# EasyEDA Pro project ProPrj_智能视觉集成板-V1.1.epro, board PCB2_1
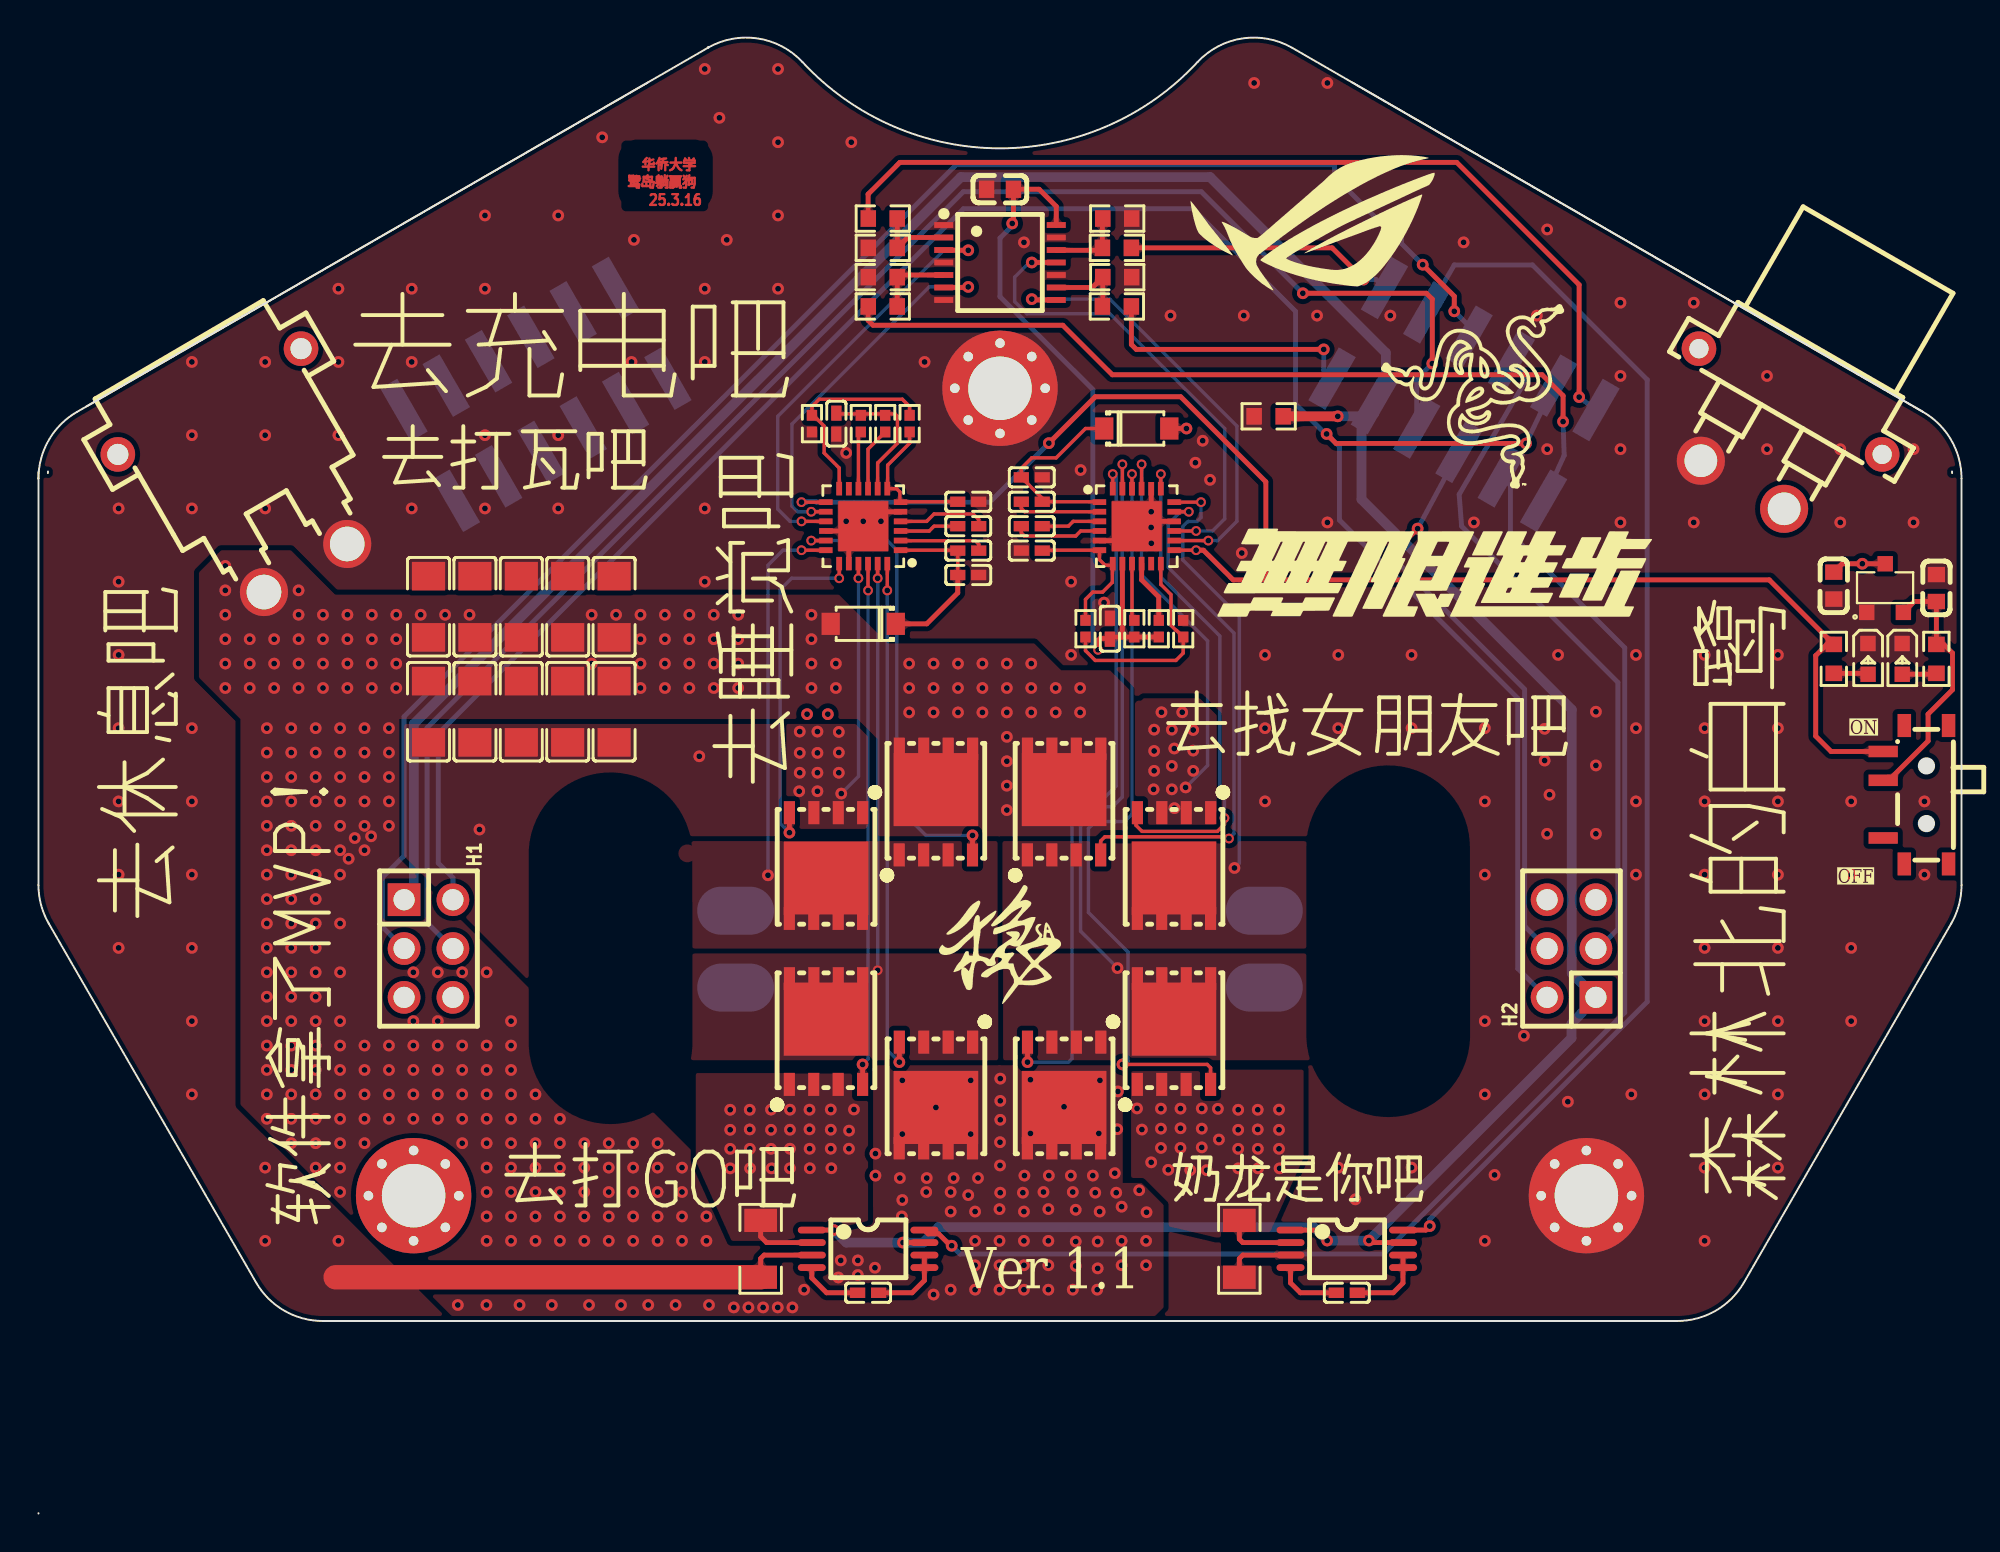
[diagram p9: board, top side]
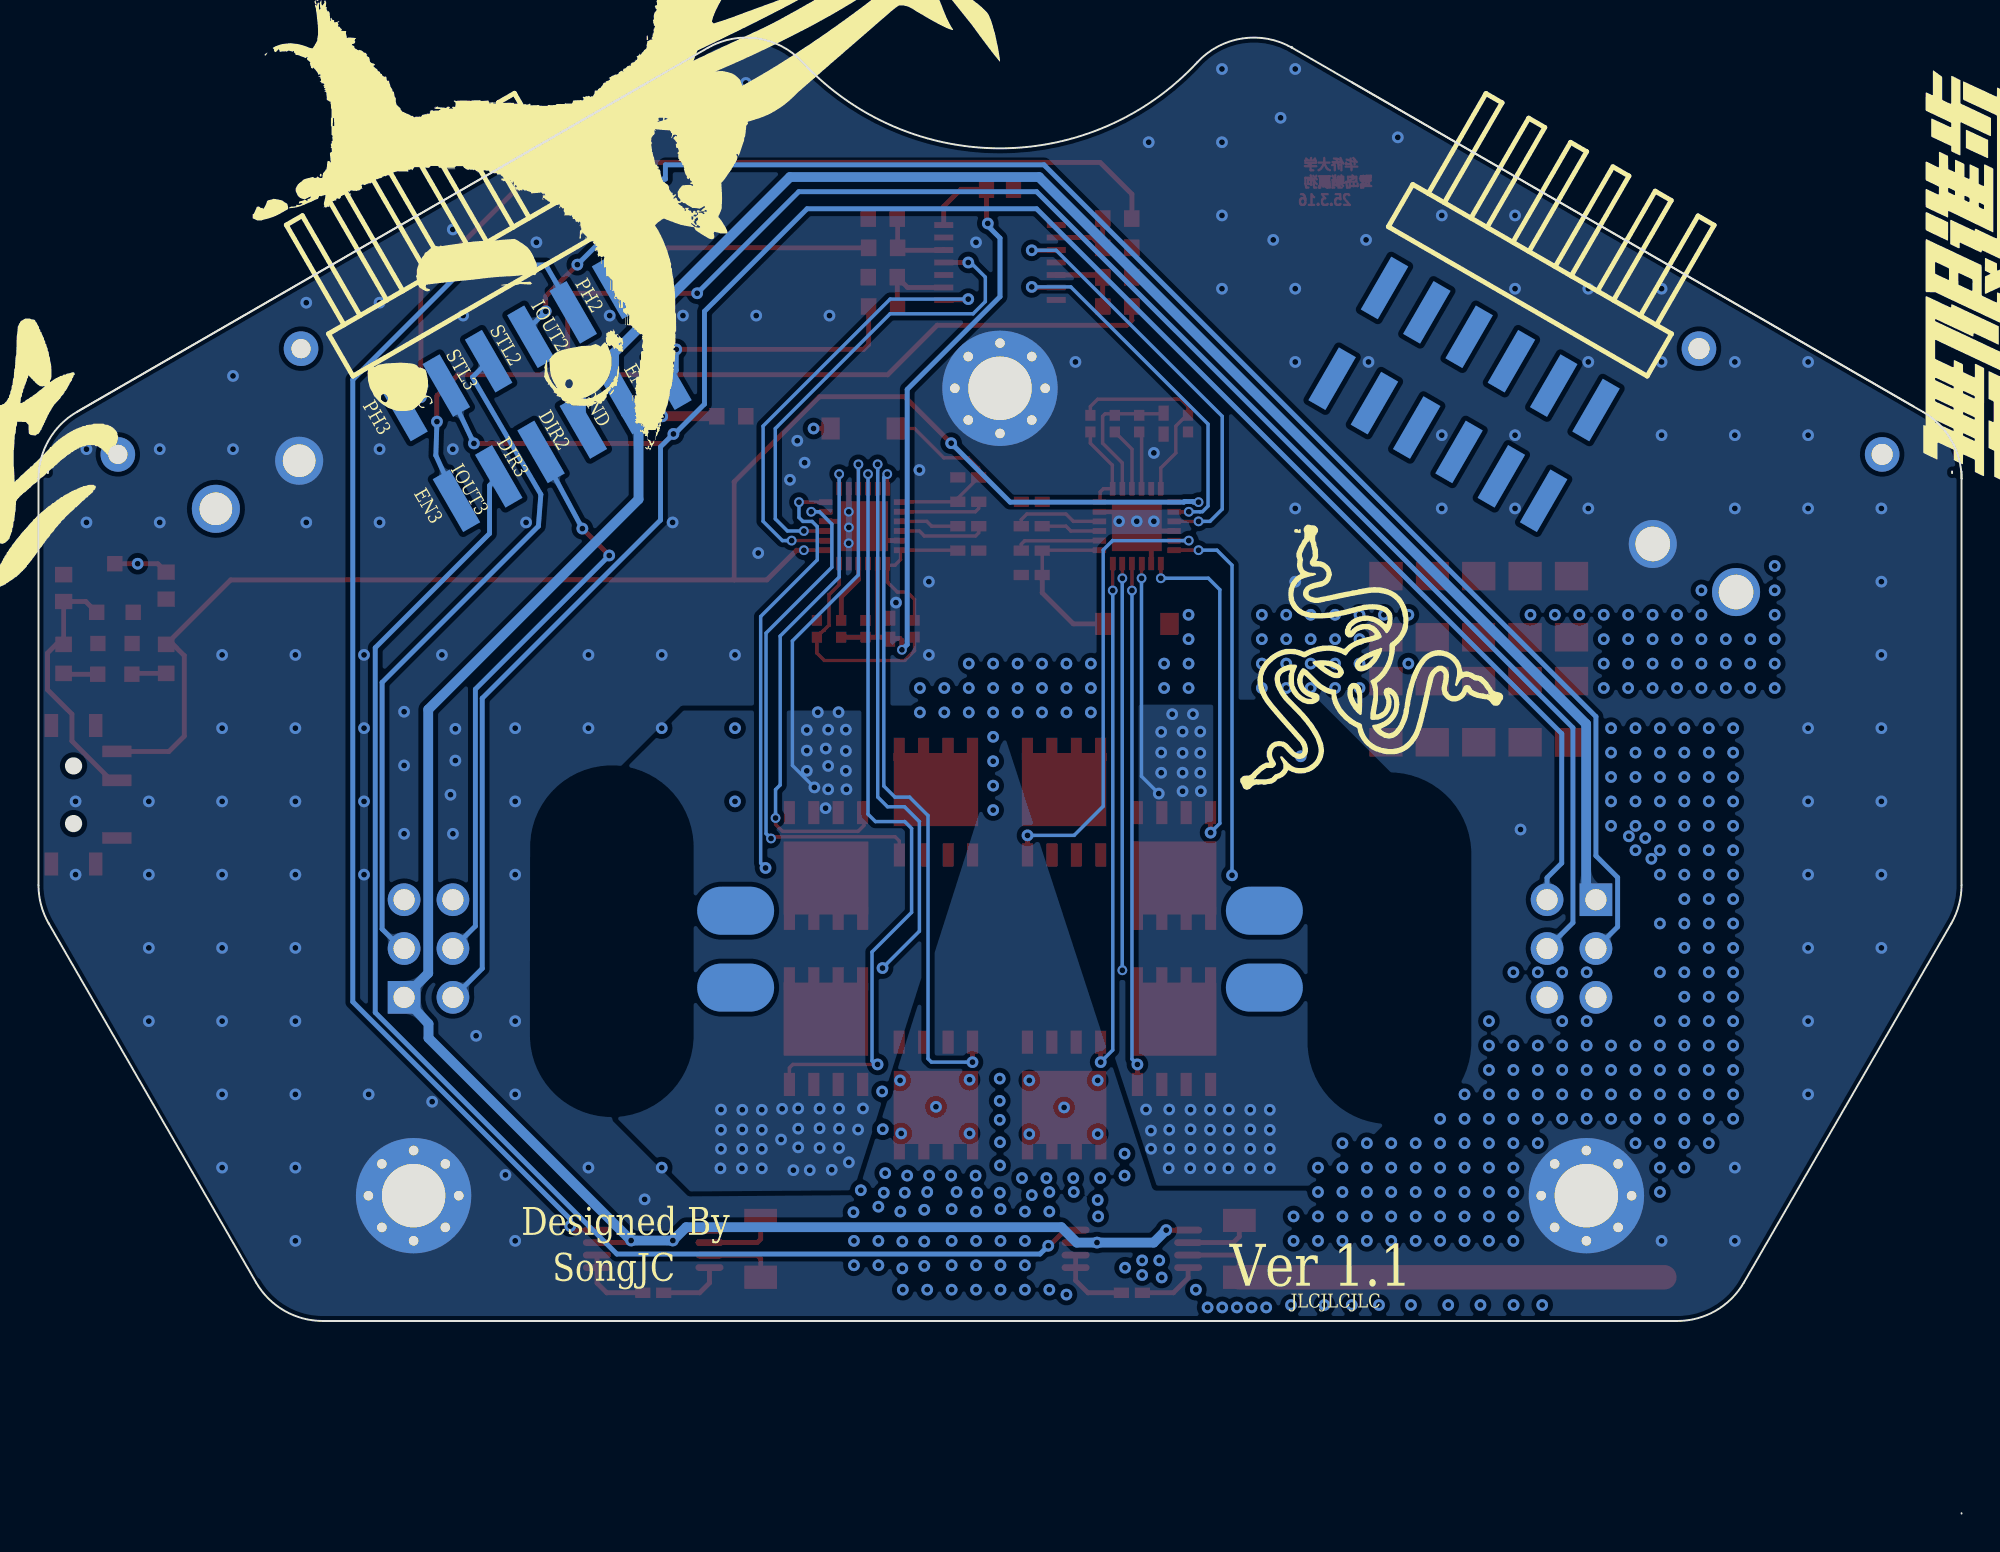
[diagram p10: board, bottom side, seen from below]

Outline 100 x 76.73 mm; copper layers: Top Layer, Inner1, Inner2, Bottom Layer. Coordinates in mm from the lower left corner of the outline.
Outline path: 0,54.21 0,53.84 ; 0,53.84 0,32.69 arc(0.14,31.66) 0.54,30.69 11.32,12.02 arc(12.78,10.55) 14.78,10.02 85.22,10.02 arc(87.22,10.55) 88.68,12.02 99.46,30.69 arc(99.86,31.66) 100,32.69 100,53.84 arc(99.46,55.84) 98,57.3 ; 0,53.84 arc(0.54,55.84) 2,57.3 34.84,76.27 ; 0,0.02 0,0 ; 0.49,54.21 0.49,54.13 ; 31.71,74.46 2.49,57.59 ; 34.8,76.24 arc(37.4,76.73) 39.73,75.5 arc(50,71.02) 60.27,75.5 arc(62.6,76.73) 65.2,76.24 98,57.3 ; 34.83,76.3 arc(34.83,76.3) 34.83,76.3 ; 98,57.3 68.29,74.46 ; 99.51,54.21 99.51,54.13
Stack: Top Layer 0.035mm 外层铜厚1oz / Dielectric1 0.2104mm 7628 RC49% 8.6mil / Inner1 0.0152mm 内层铜厚 / Dielectric2 1.065mm 1.1mm H/HOZ Copper / Inner2 0.0152mm 内层铜厚 / Dielectric3 0.2104mm 7628 RC49% 8.6mil / Bottom Layer 0.035mm 外层铜厚1oz

## Design rules (mm)
template: 自定义配置
spacing copperThickness1oz (default): track to track 0.102, other pairs 0.14 to 0.3
spacing copperThickness2oz: track to track 0.203, other pairs 0.152 to 0.3
track width copperThickness1oz (default): min 0.127, default 0.254, max 2.54
track width copperThickness2oz: min 0.203, default 0.254, max 2.54
differential pair differentialPair (default): width min 0.127, default 0.254, max 2.54; gap min 0.152, default 0.152
via viaSize (default): diameter min 0.5, default 0.61, max 10; hole min 0.3, default 0.305, max 6.299
net VCC_BAT uses copperRegion1
net GND_MOTO uses copperRegion1
net SH2_2 uses copperRegion1
net SP_2 uses copperRegion1
net SH1_2 uses copperRegion1
net SH2_3 uses copperRegion1
net SP_3 uses copperRegion1
net SH1_3 uses copperRegion1

## Placement (name value [footprint] x y rotation side)
C44  1nF  [C0603]  93.36 48.27 90 top
C45  1nF  [C0603]  98.69 48.14 270 top
C94  22uF  [c1206]  25.11 47.17 270 top
C95  22uF  [c1206]  22.69 47.17 270 top
C96  22uF  [c1206]  20.28 47.17 270 top
C97  22uF  [c1206]  20.28 41.71 90 top
C132  100nF  [C0603]  50 68.89 0 top
C133  22uF  [c1206]  29.93 47.17 270 top
C134  22uF  [c1206]  27.52 47.17 270 top
C135  22uF  [c1206]  22.69 41.71 90 top
C136  22uF  [c1206]  25.11 41.71 90 top
C137  22uF  [c1206]  27.52 41.71 90 top
C142  22uF  [c1206]  29.93 41.71 90 top
C143  100nF  [C0402]  51.65 53.9 180 top
C144  100nF  [C0402]  51.65 52.63 180 top
C145  100nF  [C0402]  51.65 51.36 180 top
C146  1uF  [C0402]  51.65 50.09 0 top
C147  1uF  [C0402]  55.72 46.03 270 top
C148  100nF  [C0402]  68.03 11.48 180 top
C149  100nF  [C0402]  48.35 48.82 180 top
C150  100nF  [C0402]  48.35 50.09 0 top
C151  100nF  [C0402]  48.35 51.36 0 top
C152  1uF  [C0402]  48.35 52.63 180 top
C153  1uF  [C0402]  41.49 56.7 90 top
C154  100nF  [C0402]  43.14 11.48 180 top
CN6  XT30PW-M30.G.Y  [CONN-TH_XT30PW-M]  11.39 53.52 210 top
D29  B5819W  [SOD-123_L2.8-W1.8-LS3.7-RD]  57.11 56.44 0 top
D30  B5819W  [SOD-123_L2.8-W1.8-LS3.7-RD]  42.89 46.28 180 top
H1  PZ254V-12-6P  [HDR-TH_6P-P2.54-V-M-R2-C3-S2.54]  20.28 29.39 270 top
H2  PZ254V-12-6P  [HDR-TH_6P-P2.54-V-M-R2-C3-S2.54]  79.72 29.39 90 top
J1  -  [M3螺帽]  19.51 16.54 0 top
J2  -  [M3螺帽]  50 58.54 0 top
J4  -  [M3螺帽]  80.49 16.54 0 top
LED4  NCD0603R1  [LED0603-RD_RED]  96.91 44.46 270 top
LED5  NCD0603R1  [LED0603-RD_RED]  95.14 44.46 270 top
Q25  IRFH7440TRPBF  [DFN-8_L5.8-W4.9-P1.27-LS6.0-BL-1]  53.33 21.77 180 top
Q26  IRFH7440TRPBF  [DFN-8_L5.8-W4.9-P1.27-LS6.0-BL-1]  59.05 25.07 0 top
Q27  IRFH7440TRPBF  [DFN-8_L5.8-W4.9-P1.27-LS6.0-BL-1]  53.33 37.01 0 top
Q28  IRFH7440TRPBF  [DFN-8_L5.8-W4.9-P1.27-LS6.0-BL-1]  59.05 33.71 180 top
Q29  IRFH7440TRPBF  [DFN-8_L5.8-W4.9-P1.27-LS6.0-BL-1]  46.67 21.77 180 top
Q30  IRFH7440TRPBF  [DFN-8_L5.8-W4.9-P1.27-LS6.0-BL-1]  40.95 25.07 0 top
Q31  IRFH7440TRPBF  [DFN-8_L5.8-W4.9-P1.27-LS6.0-BL-1]  46.67 37.01 0 top
Q32  IRFH7440TRPBF  [DFN-8_L5.8-W4.9-P1.27-LS6.0-BL-1]  40.95 33.71 180 top
R68  2.2K  [R0603]  98.69 44.46 90 top
R69  2.2K  [R0603]  93.36 44.46 90 top
R89  100R  [R0603]  56.08 65.84 0 top
R90  100R  [R0603]  56.08 62.79 0 top
R173  10kΩ  [R0603]  43.9 64.32 0 top
R174  10kΩ  [R0603]  43.9 65.84 0 top
R175  10kΩ  [R0603]  56.1 64.32 180 top
R176  10kΩ  [R0603]  56.1 67.36 180 top
R177  10kΩ  [R0402]  56.99 46.03 90 top
R178  10kΩ  [R0402]  58.26 46.03 90 top
R179  1kΩ  [R0402]  54.44 46.03 270 top
R180  33kΩ  [R0402]  59.53 46.03 270 top
R181  10kΩ  [R0402]  44.03 56.7 270 top
R182  10kΩ  [R0402]  42.76 56.7 270 top
R183  1kΩ  [R0402]  45.3 56.7 90 top
R184  33kΩ  [R0402]  40.22 56.7 90 top
R185  100R  [R0603]  43.9 67.36 180 top
R186  100R  [R0603]  43.9 62.79 180 top
R187  0Ω  [R0603]  63.97 57.08 180 top
SW4  MSK12C02  [SW-TH_MSK12C02]  97.62 37.39 90 top
U10  LR8341A-T33  [SOT-23-3L_L2.9-W1.6-P1.90-LS2.8-BL]  96.02 48.14 0 top
U11  SN74HC125PWR  [TSSOP-14_L5.0-W4.4-P0.65-LS6.5-BL]  50 65.08 270 top
U56  XT30PW-F20.G.Y  [CONN-TH_XT30PW-F-1]  89.86 55.68 150 top
U57  PZ254-2-06-WS  [HDR-SMD_12P-P2.54_HCTL_PZ254-2-06-WS]  25.87 58.22 30 bottom
U58  PZ254-2-06-WS  [HDR-SMD_12P-P2.54_HCTL_PZ254-2-06-WS]  74.13 58.22 330 bottom
U59  100mΩ  [R1206]  62.45 13.77 270 top
U60  DRV8701ERGER  [VQFN-24_L4.0-W4.0-P0.50-BL-EP2.5]  57.11 51.36 270 top
U61  INA240A2PWR  [TSSOP-8_L4.4-W3.0-P0.65-LS6.4-BL]  68.03 13.77 270 top
U62  -  [2P焊接端子（大电流）]  63.75 29.36 0 bottom
U63  100mΩ  [R1206]  37.55 13.77 270 top
U64  DRV8701ERGER  [VQFN-24_L4.0-W4.0-P0.50-BL-EP2.5]  42.89 51.36 90 top
U65  INA240A2PWR  [TSSOP-8_L4.4-W3.0-P0.65-LS6.4-BL]  43.14 13.77 270 top
U66  -  [2P焊接端子（大电流）]  36.25 29.36 0 bottom

## Footprints (pads in the part's own frame, mm; a bottom-side part is the same pattern mirrored in y, then rotated)
2P焊接端子（大电流）
  oval 4x2.5 smd: 1(0,2) 2(0,-2)
C0402
  rect 0.79x0.54 smd: 1(-0.545,0) 2(0.545,0)
C0603
  rect 0.8x0.9 smd: 1(-0.7,0) 2(0.7,0)
c1206
  rect 1.485x1.728 smd: 1(-1.593,0) 2(1.593,0)
CONN-TH_XT30PW-F-1
  round 2.5 hole 1.7: 1(-2.5,2.5) 2(2.5,2.5)
  round 1.8 hole 1: 3(5.5,-2.5) 4(-5.5,-2.5)
CONN-TH_XT30PW-M
  round 2.5 hole 1.8: 1(-2.5,5) 2(2.5,5)
  round 1.8 hole 1.1: 3(5.5,-5) 4(-5.5,-5)
DFN-8_L5.8-W4.9-P1.27-LS6.0-BL-1
  rect 0.58x1.2 smd: 1(-1.907,-2.75) 2(-0.637,-2.75) 3(0.632,-2.75) 4(1.903,-2.75) 5(1.907,2.75) 6(0.637,2.75) 7(-0.632,2.75) 8(-1.903,2.75)
  rect 4.4x3.8 smd: 9(0,0.646)
HDR-SMD_12P-P2.54_HCTL_PZ254-2-06-WS
  rect 1.02x3.17 smd: 1(-6.35,-2.725) 2(-6.35,2.725) 3(-3.81,-2.725) 4(-3.81,2.725) 5(-1.27,-2.725) 6(-1.27,2.725) 7(1.27,-2.725) 8(1.27,2.725) 9(3.81,-2.725) 10(3.81,2.725) 11(6.35,-2.725) 12(6.35,2.725)
HDR-TH_6P-P2.54-V-M-R2-C3-S2.54
  rect 1.7x1.7 hole 1.1: 1(-2.54,-1.27)
  round 1.7 hole 1.1: 2(-2.54,1.27) 3(0,-1.27) 4(0,1.27) 5(2.54,-1.27) 6(2.54,1.27)
LED0603-RD_RED
  rect 0.8x0.8 smd: 1(-0.799,-0.004) 2(0.799,0.004)
M3螺帽
  round 6 hole 3.302: 1(0,0)
  round 1 hole 0.5: 2(0,2.349) 3(0,-2.349) 4(2.349,0) 5(-2.349,0) 6(1.651,1.651) 7(-1.651,-1.651) 8(1.651,-1.651) 9(-1.651,1.651)
R0402
  rect 0.566x0.54 smd: 1(-0.433,0) 2(0.433,0)
R0603
  rect 0.806x0.864 smd: 1(-0.753,0) 2(0.753,0)
R1206
  rect 1.208x1.701 smd: 1(-1.479,0) 2(1.479,0)
SOD-123_L2.8-W1.8-LS3.7-RD
  rect 0.95x1.15 smd: 1(-1.692,0) 2(1.692,0)
SOT-23-3L_L2.9-W1.6-P1.90-LS2.8-BL
  rect 0.8x0.8 smd: 1(-0.95,-1.265) 2(0.95,-1.265) 3(0.005,1.265)
SW-TH_MSK12C02
  rect 0.6x1.524 smd: 1(-2.25,1.7) 2(0.75,1.7) 3(2.25,1.7)
  rect 1.2x0.7 smd: 4(-3.6,0.6) 4(-3.6,-1.7) 4(3.6,0.6) 4(3.6,-1.7)
TSSOP-8_L4.4-W3.0-P0.65-LS6.4-BL
  oval 0.353x1.454 smd: 1(-0.975,-2.927) 2(-0.325,-2.927) 3(0.325,-2.927) 4(0.975,-2.927) 5(0.975,2.927) 6(0.325,2.927) 7(-0.325,2.927) 8(-0.975,2.927)
TSSOP-14_L5.0-W4.4-P0.65-LS6.5-BL
  rect 0.305x0.991 smd: 1(-1.95,-2.925) 2(-1.3,-2.925) 3(-0.65,-2.925) 4(0,-2.925) 5(0.65,-2.925) 6(1.3,-2.925) 7(1.95,-2.925) 8(1.95,2.925) 9(1.3,2.925) 10(0.65,2.925) 11(0,2.925) 12(-0.65,2.925) 13(-1.3,2.925) 14(-1.95,2.925)
VQFN-24_L4.0-W4.0-P0.50-BL-EP2.5
  rect 0.3x0.7 smd: 1(-1.25,-1.942) 2(-0.75,-1.942) 3(-0.25,-1.942) 4(0.25,-1.942) 5(0.75,-1.942) 6(1.25,-1.942) 13(1.25,1.942) 14(0.75,1.942) 15(0.25,1.942) 16(-0.25,1.942) 17(-0.75,1.942) 18(-1.25,1.942)
  rect 0.7x0.3 smd: 7(1.948,-1.25) 8(1.948,-0.75) 9(1.948,-0.25) 10(1.948,0.25) 11(1.948,0.75) 12(1.948,1.25) 19(-1.948,1.25) 20(-1.948,0.75) 21(-1.948,0.25) 22(-1.948,-0.25) 23(-1.948,-0.75) 24(-1.948,-1.25)
  rect 2.6x2.6 smd: 25(0.001,-0.001)

## Nets
As in the schematic, except:
GND_MOTO: C44.1 C45.1 C94.1 C95.1 C96.1 C97.1 C132.1 C133.1 C134.1 C135.1 C136.1 C137.1 C142.1 C143.1 C146.1 C147.1 C149.1 C152.1 C153.1 CN6.1 J1.1 J1.2 J1.3 J1.4 J1.5 J1.6 J1.7 J1.8 J1.9 J2.1 J2.2 J2.3 J2.4 J2.5 J2.6 J2.7 J2.8 J2.9 J4.1 J4.2 J4.3 J4.4 J4.5 J4.6 J4.7 J4.8 J4.9 LED4.1 LED5.1 R173.1 R174.1 R175.1 R176.1 R180.1 R184.1 R187.2 U10.1 U11.1 U11.4 U11.7 U11.10 U11.13 U56.2 U59.2 U60.5 U60.16 U60.20 U60.25 U61.3 U63.2 U64.5 U64.16 U64.20 U64.25 U65.3

Pads without a net: CN6 3 4; H1 5 6; H2 5 6; SW4 1 4; U56 1 3 4; U57 1 2 3 4 5 6 7 8 9 10 11 12; U60 11; U64 11

## Via types
v1: diameter 0.61, hole 0.305, Top Layer to Bottom Layer, 622 vias
v2: diameter 0.508, hole 0.305, Top Layer to Bottom Layer, 27 vias

## Routing (per net, layer and track width the routed paths; a pad name or vN(x,y) marks a point on that pad's centre or on a via; arc(x,y) is an arc through that point)
+3V3: length 13.5
  Top Layer w0.254: SW4.2 96.22,38.14 98.26,40.19 98.26,41.58 99.53,42.85 99.53,44.76 99.08,45.21 R68.2 C45.2 97.54,47.44 U10.2
AVDD_2: length 8.1
  Top Layer w0.178: 55.84,49.39 U60.7 ; 55.84,49.39 55.78,49.33 55.46,49.33 55.17,49.62 U60.6 52.22,50.11 C146.2 ; 55.84,49.39 55.84,48.44 55.33,47.93 54.83,47.93 54.44,47.55 R179.1
AVDD_3: length 7.7
  Top Layer w0.178: C152.2 44.85,52.63 U64.6 44.79,52.65 44.79,53.14 44.62,53.31 U64.7 44.16,53.33 44.16,54.54 45.3,55.68 R183.1
DVDD_2: length 37.5
  Top Layer w0.178: 55.83,45.6 C147.2
  Top Layer w0.254: v2(55.1,44.93) 55.1,45.41 55.21,45.52 55.68,45.52 C147.2 ; 56.34,45.6 56.36,45.62 U60.8 ; 56.34,45.6 55.83,45.6 ; 56.34,45.6 R177.1 R178.1 ; v1(50.63,67.11) 50.7,67.18 C132.2 52.03,68.89 52.93,68 U11.14
  Bottom Layer w0.254: v1(50.63,67.11) 50.63,66.98 50,66.35 50,63.3 54.83,58.47 54.83,45.2 v2(55.1,44.93)
DVDD_3: length 7.4
  Top Layer w0.178: C153.2 41.53,57.2 44.54,57.2 44.67,57.08 44.67,55.68 43.64,54.65 U64.8
GND_MOTO: length 41.9
  Top Layer w0.254: U59.2 62.45,13.26 62.63,13.45 U61.3 ; 57.36,51.61 U60.25 56.36,50.61 U60.5 ; 57.36,51.61 U60.16 ; 57.36,51.61 v2(57.86,52.11) U60.20 ; U64.16 42.64,51.11 ; 42.64,51.11 42.14,50.61 U64.20 ; 42.64,51.11 U64.25 43.64,52.11 U64.5 ; U65.3 37.74,13.45 37.55,13.26 U63.2
  Top Layer w1.27: U63.2 15.46,12.29
  vias: v1(4.17,52.29) v1(4.17,48.48) v1(4.17,44.67) v1(4.17,40.86) v1(4.17,37.05) v1(4.17,33.24) v1(4.17,29.43) v1(7.98,59.91) v1(7.98,56.1) v1(7.98,52.29) v1(7.98,40.86) v1(7.98,37.05) v1(7.98,33.24) v1(7.98,29.43) v1(7.98,25.62) v1(7.98,21.81) v1(11.79,59.91) v1(11.79,56.1) v1(11.79,52.29) v1(11.79,18) v1(11.79,14.19) v1(15.6,63.72) v1(15.6,59.91) v1(15.6,56.1) v1(15.6,14.19) v1(19.41,63.72) v1(19.41,59.91) v1(19.41,52.29) v1(22.93,35.58) v1(23.22,67.53) v1(23.22,63.72) v1(23.22,56.1) v1(23.22,52.29) v1(27.03,67.53) v1(27.03,56.1) v1(27.03,52.29) v1(29.31,71.59) v1(30.84,59.91) v1(30.97,66.26) v1(34.36,39.39) v1(34.65,75.15) v1(34.65,63.72) v1(34.65,59.91) v1(34.65,52.29) v1(34.65,48.48) v1(35.41,72.61) v1(35.79,66.26) v1(38.46,75.15) v1(38.46,71.34) v1(38.46,67.53) v1(38.46,63.72) v1(42,55.17) v1(42,51.62) v1(42.27,71.34) v1(42.89,51.62) v1(43.81,51.62) v1(46.08,59.91) v1(51.25,66.13) v1(53.7,48.48) v1(53.7,44.67) v1(54.19,54.28) v1(55.41,47.39) v1(58.87,62.32) v1(60.16,54.66) v1(60.54,55.81) v1(60.92,53.78) v1(62.57,49.97) v1(62.68,62.32) v1(63.21,74.42) v1(63.78,44.67) v1(63.78,40.86) v1(63.78,37.05) v1(66.49,62.32) v1(67.02,74.42) v1(67.02,51.56) v1(67.59,44.67) v1(67.59,40.86) v1(67.59,18) v1(68.48,16.34) v1(70.3,66.13) v1(70.3,62.32) v1(71.4,44.67) v1(71.4,40.86) v1(71.4,18) v1(74.11,66.13) v1(74.64,51.56) v1(75.21,40.86) v1(75.21,37.05) v1(75.21,33.24) v1(75.21,25.62) v1(75.21,21.81) v1(75.21,14.19) v1(75.72,17.61) v1(77.24,24.85) v1(77.92,62.32) v1(78.32,40.82) v1(78.32,39.17) v1(78.45,35.36) v1(78.45,66.8) v1(78.45,55.37) v1(78.57,37.39) v1(79.02,44.67) v1(79.53,21.42) v1(80.99,41.71) v1(80.99,38.92) v1(80.99,35.36) v1(82.26,62.99) v1(82.26,59.18) v1(82.26,55.37) v1(82.26,51.56) v1(82.83,21.81) v1(83.07,44.67) v1(83.07,40.86) v1(83.07,37.05) v1(83.07,33.24) v1(86.07,62.99) v1(86.07,51.56) v1(86.64,44.67) v1(86.64,40.86) v1(86.64,37.05) v1(86.64,33.24) v1(86.64,29.43) v1(86.64,25.62) v1(86.64,21.81) v1(86.64,18) v1(86.64,14.19) v1(89.88,59.18) v1(89.88,55.37) v1(90.45,44.67) v1(90.45,40.86) v1(90.45,37.05) v1(90.45,33.24) v1(90.45,29.43) v1(90.45,25.62) v1(90.45,21.81) v1(90.45,18) v1(93.69,55.37) v1(93.69,51.56) v1(94.26,37.05) v1(94.26,33.24) v1(94.26,29.43) v1(94.26,25.62) v1(97.5,55.37) v1(97.5,51.56) v1(98.07,37.05) v1(98.07,33.24) v2(57.86,51.3) v2(57.87,50.47)
GND_PRO: length 172
  Top Layer w0.254: v1(67.01,14.2) 66.47,14.75 U61.1 ; v1(69.18,14.2) 69.29,14.1 U61.7 ; U65.7 v1(44.96,14.1) ; v1(41.36,14.75) U65.1
  Top Layer w0.508: R187.1 v1(67.56,57.08)
  Bottom Layer w0.508: U58.4 70.07,58.37 70.07,60.38 60.92,69.52 47.97,69.52 19.52,41.08 19.52,32.44 H1.1 ; U58.4 68.78,57.08 v1(67.56,57.08) ; U58.4 69.47,57.24 68.8,56.57 68.8,52.76 79.73,41.82 79.73,28.11 H2.1 79.72,25.47 79.72,24.74 v1(69.18,14.2) v1(67.01,14.2) 66.32,14.9 46.81,14.9 46.01,14.1 v1(44.96,14.1) 42.01,14.1 v1(41.36,14.75)
VCC_3V3: length 122.1
  Top Layer w0.254: v1(66.98,56.16) 67.48,55.67 v1(77.35,55.67)
  Bottom Layer w0.254: H2.2 78.43,26.85 76.92,28.35 76.92,42.41 67.65,51.68 67.65,55.49 v1(66.98,56.16) 66.92,56.16 65.37,57.71 65.37,62.54 60.03,67.87 48.09,67.87 20.79,40.57 20.79,33.84 21.55,33.07 H1.2 ; v1(77.35,55.67) U58.9
VCC_BAT: length 3.7
  Top Layer w0.254: U10.3 v1(94.84,49.41) 93.8,49.41 C44.2 ; v1(59.69,56.44) D29.2
  vias: v1(9.72,49.29) v1(9.72,48.02) v1(9.72,46.75) v1(9.72,45.48) v1(9.72,44.21) v1(9.72,42.94) v1(10.99,45.48) v1(10.99,44.21) v1(10.99,42.94) v1(11.87,40.86) v1(11.87,39.59) v1(11.87,38.32) v1(11.87,37.05) v1(11.87,35.78) v1(11.87,34.51) v1(11.87,33.24) v1(11.87,31.97) v1(11.87,30.7) v1(11.87,29.43) v1(11.87,28.16) v1(11.87,26.89) v1(11.87,25.62) v1(11.87,24.35) v1(11.87,23.08) v1(11.87,21.81) v1(11.87,20.54) v1(12.26,45.48) v1(12.26,44.21) v1(12.26,42.94) v1(13.14,40.86) v1(13.14,39.59) v1(13.14,38.32) v1(13.14,37.05) v1(13.14,35.78) v1(13.14,34.51) v1(13.14,33.24) v1(13.14,31.97) v1(13.14,30.7) v1(13.14,29.43) v1(13.14,28.16) v1(13.14,26.89) v1(13.14,25.62) v1(13.14,24.35) v1(13.14,23.08) v1(13.14,21.81) v1(13.14,20.54) v1(13.14,19.27) v1(13.53,48.02) v1(13.53,46.75) v1(13.53,45.48) v1(13.53,44.21) v1(13.53,42.94) v1(14.41,40.86) v1(14.41,39.59) v1(14.41,38.32) v1(14.41,37.05) v1(14.41,35.78) v1(14.41,34.51) v1(14.41,33.24) v1(14.41,31.97) v1(14.41,30.7) v1(14.41,29.43) v1(14.41,28.16) v1(14.41,26.89) v1(14.41,25.62) v1(14.41,24.35) v1(14.41,23.08) v1(14.41,21.81) v1(14.41,20.54) v1(14.41,19.27) v1(14.41,18) v1(14.8,46.75) v1(14.8,45.48) v1(14.8,44.21) v1(14.8,42.94) v1(15.68,40.86) v1(15.68,39.59) v1(15.68,38.32) v1(15.68,37.05) v1(15.68,35.78) v1(15.68,34.51) v1(15.68,33.24) v1(15.68,30.7) v1(15.68,28.16) v1(15.68,25.62) v1(15.68,24.35) v1(15.68,23.08) v1(15.68,21.81) v1(15.68,20.54) v1(15.68,19.27) v1(15.68,18) v1(15.68,16.73) v1(16.07,46.75) v1(16.07,45.48) v1(16.07,44.21) v1(16.07,42.94) v1(16.13,34.06) v1(16.45,35.14) v1(16.95,40.86) v1(16.95,39.59) v1(16.95,38.32) v1(16.95,37.05) v1(16.95,35.78) v1(16.95,34.51) v1(16.95,24.35) v1(16.95,23.08) v1(16.95,21.81) v1(16.95,20.54) v1(16.95,19.27) v1(17.34,46.75) v1(17.34,45.48) v1(17.34,44.21) v1(17.34,42.94) v1(17.3,35.23) v1(18.22,40.86) v1(18.22,39.59) v1(18.22,38.32) v1(18.22,37.05) v1(18.22,35.78) v1(18.22,24.35) v1(18.22,23.08) v1(18.22,21.81) v1(18.22,20.54) v1(18.61,46.75) v1(18.61,45.48) v1(18.61,44.21) v1(18.61,42.94) v1(19.49,28.16) v1(19.49,25.62) v1(19.49,24.35) v1(19.49,23.08) v1(19.49,21.81) v1(19.49,20.54) v1(19.88,46.75) v1(20.76,28.16) v1(20.76,25.62) v1(20.76,24.35) v1(20.76,23.08) v1(20.76,21.81) v1(20.76,20.54) v1(21.15,46.75) v1(21.81,10.85) v1(22.03,28.16) v1(22.03,24.35) v1(22.03,23.08) v1(22.03,21.81) v1(22.03,20.54) v1(22.03,19.27) v1(22.42,46.75) v1(23.3,28.16) v1(23.3,24.35) v1(23.3,23.08) v1(23.3,21.81) v1(23.3,20.54) v1(23.3,19.27) v1(23.3,18) v1(23.3,16.73) v1(23.3,15.46) v1(23.3,14.19) v1(23.29,10.85) v1(24.57,25.62) v1(24.57,24.35) v1(24.57,23.08) v1(24.57,21.81) v1(24.57,20.54) v1(24.57,19.27) v1(24.57,18) v1(24.57,16.73) v1(24.57,15.46) v1(24.57,14.19) v1(25.02,10.85) v1(25.84,21.81) v1(25.84,20.54) v1(25.84,19.27) v1(25.84,18) v1(25.84,16.73) v1(25.84,15.46) v1(25.84,14.19) v1(26.69,10.85) v1(27.11,20.54) v1(27.11,19.27) v1(27.11,18) v1(27.11,16.73) v1(27.11,15.46) v1(27.11,14.19) v1(28.38,19.27) v1(28.38,18) v1(28.38,16.73) v1(28.38,15.46) v1(28.38,14.19) v1(28.63,10.85) v1(28.77,46.75) v1(28.77,44.21) v1(29.65,19.27) v1(29.65,18) v1(29.65,16.73) v1(29.65,15.46) v1(29.65,14.19) v1(30.04,46.75) v1(30.29,10.85) v1(30.92,19.27) v1(30.92,18) v1(30.92,16.73) v1(30.92,15.46) v1(30.92,14.19) v1(31.31,46.75) v1(31.31,45.48) v1(31.31,44.21) v1(31.31,42.94) v1(31.71,10.85) v1(32.19,19.27) v1(32.19,18) v1(32.19,16.73) v1(32.19,15.46) v1(32.19,14.19) v1(32.58,46.75) v1(32.58,45.48) v1(32.58,44.21) v1(32.58,42.94) v1(33.13,10.85) v1(33.46,18) v1(33.46,16.73) v1(33.46,15.46) v1(33.46,14.19) v1(33.85,46.75) v1(33.85,45.48) v1(33.85,44.21) v1(33.85,42.94) v1(34.73,15.46) v1(34.73,14.19) v1(34.87,10.85) v1(35.12,46.75) v1(35.12,45.48) v1(35.12,44.21) v1(35.12,42.94) v1(36.16,10.72) v1(36.39,46.75) v1(36.39,45.48) v1(36.39,44.21) v1(36.39,42.94) v1(36.92,10.72) v1(37.68,10.72) v1(38.44,10.72) v1(39.21,10.72) v1(39.81,11.65) v1(40.2,46.75) v1(40.2,45.48) v1(40.2,44.21) v1(40.2,42.94) v1(41.47,44.21) v1(41.47,42.94) v1(41.59,12.28) v1(41.72,13.17) v1(42.61,13.17) v1(42.61,12.41) v1(43.52,18.72) v1(43.52,17.58) v1(43.5,12.79) v1(44.79,17.45) v1(44.92,22.53) v1(44.92,19.74) v1(44.92,16.31) v1(44.89,15.46) v1(45.28,44.21) v1(45.28,42.94) v1(45.28,41.67) v1(46.19,17.45) v1(46.16,16.73) v1(46.55,44.21) v1(46.55,42.94) v1(46.55,41.67) v1(46.55,11.39) v1(46.67,21.13) v1(47.43,16.73) v1(47.43,15.71) v1(47.43,11.65) v1(47.59,17.45) v1(47.82,44.21) v1(47.82,42.94) v1(47.82,41.67) v1(48.35,16.56) v1(48.48,22.53) v1(48.48,19.74) v1(48.7,15.71) v1(48.7,14.19) v1(48.7,12.92) v1(48.7,11.65) v1(48.86,17.45) v1(49.09,44.21) v1(49.09,42.94) v1(49.09,41.67) v1(50.01,22.63) v1(50.01,21.47) v1(50.01,20.48) v1(50,19.32) v1(50,18.11) v1(50.01,16.69) v1(49.97,15.84) v1(49.97,14.19) v1(49.97,12.92) v1(49.97,11.65) v1(50.36,44.21) v1(50.36,42.94) v1(50.36,41.67) v1(50.36,40.4) v1(50.36,39.13) v1(50.36,37.86) v1(50.36,36.59) v1(51.19,16.69) v1(51.24,15.71) v1(51.24,14.19) v1(51.24,12.92) v1(51.24,11.65) v1(51.27,17.58) v1(51.63,44.21) v1(51.63,42.94) v1(51.63,41.67) v1(51.58,22.57) v1(51.58,19.77) v1(52.26,16.73) v1(52.54,17.58) v1(52.51,15.84) v1(52.51,14.19) v1(52.51,12.92) v1(52.51,11.65) v1(52.9,42.94) v1(52.9,41.67) v1(53.33,21.16) v1(53.68,17.58) v1(53.78,16.73) v1(53.78,11.65) v1(53.94,15.8) v1(53.94,14.15) v1(53.94,12.88) v1(54.17,42.94) v1(54.17,41.67) v1(54.83,17.58) v1(54.95,16.69) v1(55.14,19.77) v1(55.08,14.15) v1(55.08,12.75) v1(55.05,11.65) v1(55.2,22.53) v1(55.18,15.71) v1(55.97,17.71) v1(56.04,16.69) v1(56.13,21.96) v1(56.1,19.99) v1(56.32,15.96) v1(56.32,14.19) v1(56.32,12.92) v1(57.24,16.82) v1(57.62,15.68) v1(57.59,14.19) v1(57.59,12.92)
EN-IN_2: length 4.2
  Top Layer w0.254: 55.33,62.79 55.34,62.81 R175.2 54.8,63.78 52.93,63.78
EN-IN_3: length 4
  Top Layer w0.254: R186.1 R173.2 44.77,64.43 U11.5
EN_2: length 23.3
  Top Layer w0.178: v2(60.83,50.61) U60.14
  Top Layer w0.254: U11.8 51.7,63.13 v1(51.65,63.17)
  Bottom Layer w0.178: v2(60.83,50.61) 61.31,50.61 62.32,51.62 62.32,56.57 55.72,63.17 v1(51.65,63.17)
EN_3: length 19.6
  Top Layer w0.178: v2(40.18,52.11) U64.14
  Top Layer w0.254: 47.07,63.78 48.32,63.78 v1(48.35,63.81)
  Bottom Layer w0.178: v2(40.18,52.11) 39.6,52.11 39.59,52.12 39.47,52.12 39.18,52.41 39.18,56.67 46.32,63.81 v1(48.35,63.81)
ENCODER_DIR_2: length 85.2
  Top Layer w0.254: v1(65.75,63.48) 72.17,63.48 72.48,63.17 v1(72.48,59.82)
  Bottom Layer w0.254: v1(72.48,59.82) 71.67,59.01 U58.6 ; v1(65.75,63.48) 60.47,68.76 48.09,68.76 20.21,40.87 20.21,30.74 H1.4
ENCODER_DIR_3: length 30.3
  Top Layer w0.254: v1(70.32,49.84) v1(71.72,51.24)
  Bottom Layer w0.254: v1(70.32,49.84) 77.28,42.88 77.28,30.56 H2.4 ; v1(71.72,51.24) 73.87,55.23
ENCODER_STL_2: length 85.4
  Top Layer w0.254: v1(73.62,62.54) 73.62,63.32 v1(71.98,64.97)
  Bottom Layer w0.254: v1(71.98,64.97) 70.88,66.06 70.88,66.37 70.54,66.71 70.23,66.71 67.53,69.42 67.4,69.42 67.4,70.16 47.71,70.16 19.01,41.46 19.01,34.22 17.88,33.09 17.88,30.52 H1.3 ; U58.5 74.39,61.77 v1(73.62,62.54)
ENCODER_STL_3: length 36.2
  Bottom Layer w0.254: U58.7 76.6,59.95 77.43,59.11 73.88,53.01 74,51.36 82.13,43.23 82.13,30.41 81.12,29.39 80.56,29.39
ENIN_2: length 13.8
  Top Layer w0.254: R90.2 56.83,60.81 57.09,60.56 v1(66.83,60.56)
  Bottom Layer w0.254: U58.2 66.83,59.47 v1(66.83,60.56)
ENIN_3: length 44.2
  Top Layer w0.254: v1(79.28,56.8) 79.28,58.15 78.19,59.24 55.84,59.24 53.26,61.81 43.4,61.81 43.14,62.07 43.14,62.66 43.15,62.67 R186.2
  Bottom Layer w0.254: U58.12 79.34,55.05 v1(79.28,56.8)
GH1_2: length 27.5
  Top Layer w0.178: U60.17 v2(59.82,52.11) ; Q27.4 55.24,34.99 55.45,35.2 61.82,35.2 v2(61.91,35.12)
  Bottom Layer w0.178: v2(59.82,52.11) 59.39,52.11 58.74,51.47 58.74,49.22 62.17,45.8 62.17,35.37 v2(61.91,35.12)
GH1_3: length 24.3
  Top Layer w0.178: v2(40.18,50.61) U64.17
  Top Layer w0.254: v1(48.57,35.28) Q31.4
  Bottom Layer w0.178: 48.55,35.28 46.15,35.28 44.63,36.79 44.63,50.13 44.15,50.61 v2(40.18,50.61)
GH2_2: length 36.1
  Top Layer w0.178: v2(55.86,54.07) U60.24
  Top Layer w0.254: v1(51.43,23.48) Q25.4
  Bottom Layer w0.178: v1(51.43,23.48) 53.56,23.48 53.74,23.66 53.74,36.31 54.7,37.27 55.46,37.27 56.04,37.85 56.04,53.9 v2(55.86,54.07)
GH2_3: length 27.2
  Top Layer w0.178: v2(44.14,48.02) U64.24
  Top Layer w0.254: v1(44.76,23.48) Q29.4
  Bottom Layer w0.178: v2(44.14,48.02) 44.14,24.11 v1(44.76,23.48)
GL1_2: length 25.9
  Top Layer w0.178: Q28.4 57.07,36.39 57.07,35.8 57.38,35.49 61.3,35.49 61.67,35.86 v2(61.67,36.18) ; v2(58.36,54.07) U60.19
  Bottom Layer w0.178: v2(61.67,36.18) 61.67,37.66 61.43,37.9 61.43,45.65 58.36,48.71 v2(58.36,54.07)
GL1_3: length 18
  Top Layer w0.178: v2(41.64,48.65) U64.19
  Top Layer w0.254: v1(39.05,35.42) Q32.4
  Bottom Layer w0.178: v1(39.05,35.42) 38.57,35.9 38.57,48.06 39.16,48.65 v2(41.64,48.65)
GL2_2: length 39.9
  Top Layer w0.178: v2(56.86,54.07) U60.22 ; v1(56.37,23.36) 60.77,23.36 60.95,23.19 Q26.4
  Bottom Layer w0.178: v1(56.37,23.36) 56.48,23.36 56.66,23.54 56.66,29.21 54.6,31.27 54.6,35.64 54.95,36 56.48,36 56.86,36.38 v2(56.86,54.07)
GL2_3: length 27.2
  Top Layer w0.178: v2(43.14,48.02) U64.22
  Top Layer w0.254: v1(42.85,23.36) Q30.4
  Bottom Layer w0.178: v1(42.85,23.36) 43.14,23.65 v2(43.14,48.02)
I_OUT_2: length 65.5
  Top Layer w0.254: U61.8 72.14,14.75 v1(72.35,14.95)
  Bottom Layer w0.254: v1(72.35,14.95) 72.35,15.31 83.66,26.62 83.66,58.98 77.69,64.95 73.62,64.95 72.19,62.49
I_OUT_3: length 72.7
  Top Layer w0.254: U65.8 46.26,14.55 46.81,14.55 47.43,13.93 v1(47.49,13.93)
  Bottom Layer w0.254: 76.06,53.96 76.54,53.48 76.54,50.98 82.49,45.04 82.49,26.06 69.92,13.5 47.92,13.5 v1(47.49,13.93)
NSLEEP: length 80.2
  Top Layer w0.178: v2(39.68,52.61) U64.13 ; v2(60.2,50.11) U60.13
  Top Layer w0.254: v2(60.2,50.11) 60.58,50.11 62.12,48.57 63.82,48.57 ; 63.82,48.57 90,48.57 R69.2 93,45.21 92.42,44.63 92.42,40.44 93.22,39.64 SW4.3 ; 63.82,48.57 63.82,53.67 59.4,58.09 54.95,58.09 v1(52.54,55.68)
  Bottom Layer w0.254: v2(39.68,52.61) 39.93,52.61 39.96,52.65 40.41,52.65 40.44,52.61 49.47,52.61 v1(52.54,55.68)
PH-IN_2: length 4
  Top Layer w0.254: U11.12 52.94,65.71 55.2,65.71 55.33,65.84 55.33,67.35 R176.2
PH-IN_3: length 4.2
  Top Layer w0.254: U11.2 45.2,66.38 R174.2 R185.1
PH_2: length 25
  Top Layer w0.178: U60.15 v2(60.2,51.11)
  Top Layer w0.254: U11.11 v1(51.65,65.08)
  Bottom Layer w0.178: v2(60.2,51.11) 61.05,51.11 61.68,51.74 61.68,56.44 55.72,62.41 51.4,62.41 50.76,63.05 50.76,64.32 51.52,65.08 v1(51.65,65.08)
PH_3: length 22.4
  Top Layer w0.178: v2(39.68,51.61) U64.15
  Top Layer w0.254: U11.3 47.09,65.71 v1(48.35,65.71)
  Bottom Layer w0.178: v2(39.68,51.61) 39.08,51.61 38.44,52.25 38.44,57.08 47.08,65.71 v1(48.35,65.71)
PHIN_2: length 14
  Top Layer w0.254: R89.2 67.27,65.84 68.9,64.21 v1(68.9,64.19)
  Bottom Layer w0.254: U58.1 69.56,64.19 v1(68.9,64.19)
PHIN_3: length 48.5
  Top Layer w0.254: v1(80.12,58.08) 80.12,63.92 73.75,70.29 44.79,70.29 43.14,68.63 43.14,67.37 R185.2
  Bottom Layer w0.254: v1(80.12,58.08) U58.11
SH1_2: length 22.4
  Top Layer w0.178: v2(60.45,52.61) U60.18
  Bottom Layer w0.178: v1(62.19,33.58) 62.45,33.84 62.45,46.66 59.5,49.61 59.5,51.34 59.77,51.61 60.25,51.61 60.45,51.82 v2(60.45,52.61)
SH1_3: length 19.6
  Top Layer w0.178: v2(39.68,50.11) U64.18
  Bottom Layer w0.178: 37.81,33.07 v1(37.94,33.2) 37.94,49.33 38.72,50.11 v2(39.68,50.11)
SH2_2: length 29.7
  Top Layer w0.178: v2(56.36,54.58) U60.23
  Bottom Layer w0.178: v1(56.11,28.38) 54.19,30.29 54.19,36 54.96,36.77 55.85,36.77 56.36,37.27 56.36,54.58 v2(56.36,54.58)
SH2_3: length 21.2
  Top Layer w0.178: v2(43.64,48.65) U64.23
  Bottom Layer w0.178: 43.65,28.25 v2(43.64,28.26) 43.64,28.27 43.64,48.65 v2(43.64,48.65)
SP_2: length 23.7
  Top Layer w0.178: v2(57.36,54.58) U60.21
  Top Layer w0.254: U61.2 62.63,14.1 62.45,14.28 U59.1
  Bottom Layer w0.178: v1(59.65,37.77) 60.79,38.92 60.79,45.39 57.36,48.83 v2(57.36,54.58)
  vias: v1(57.12,21.07) v1(57.38,19.98) v1(57.86,18.27) v1(58.01,40.78) v1(58.01,39.67) v1(58.01,38.64) v1(57.99,37.67) v1(58.4,41.68) v1(58.37,21.06) v1(58.37,20.02) v1(58.37,19.02) v1(58.75,17.88) v1(58.94,40.78) v1(58.94,38.89) v1(58.94,37.67) v1(59.06,39.8) v1(59.07,36.69) v1(59.38,21.06) v1(59.38,20.04) v1(59.38,19.02) v1(59.47,41.68) v1(59.89,17.86) v1(60.05,40.76) v1(60.05,39.69) v1(60.05,38.64) v1(60.49,21.07) v1(60.49,20.02) v1(60.49,19.05) v1(60.75,17.86) v1(61.33,21.05) v1(61.38,19.46) v1(62.39,21.01) v1(62.39,19.96) v1(62.39,18.97) v1(62.39,17.96) v1(63.4,21.01) v1(63.4,19.98) v1(63.41,18.97) v1(63.42,17.96) v1(64.51,21.01) v1(64.51,19.96) v1(64.51,18.97) v1(64.54,17.96)
SP_3: length 16
  Top Layer w0.178: v2(42.64,48.65) U64.21
  Top Layer w0.254: U63.1 37.55,14.41 37.86,14.1 U65.2
  Bottom Layer w0.178: v2(42.64,48.65) 42.64,48.65 42.64,38.35 v1(41.75,37.45)
  vias: v1(35.97,21.01) v1(35.97,19.96) v1(35.97,18.97) v1(35.97,17.96) v1(36.99,21.01) v1(36.99,19.98) v1(36.99,18.97) v1(37,17.96) v1(38.09,21.01) v1(38.09,19.96) v1(38.09,18.97) v1(38.12,17.96) v1(39.08,21.01) v1(39.08,19.97) v1(39.08,18.98) v1(39.08,17.96) v1(39.59,40.68) v1(39.59,39.57) v1(39.59,38.54) v1(39.56,37.57) v1(39.97,41.58) v1(40.09,21.01) v1(40.09,19.99) v1(40.1,18.98) v1(40.11,17.96) v1(40.51,40.68) v1(40.51,39.57) v1(40.51,38.54) v1(40.51,37.57) v1(41.05,41.58) v1(41.2,21.02) v1(41.2,19.97) v1(41.2,18.98) v1(41.23,17.96) v1(41.62,40.66) v1(41.62,39.59) v1(41.62,38.54) v1(42.14,18.98) v1(42.15,19.92) v1(42.41,21.02)
$2N2594: length 1.8
  Top Layer w0.254: R68.1 98.65,43.66 LED4.2
$2N2595: length 1.8
  Top Layer w0.254: LED5.2 95.09,43.71 R69.1
$2N9119: length 11.3
  Top Layer w0.178: U60.12 58.36,48.33 58.89,47.81 58.89,46.2 59.16,45.94 59.18,45.94 R180.2 59.53,44.76 59.14,44.38 54.95,44.38 54.44,44.89 R179.2
$2N9134: length 3.4
  Top Layer w0.254: C148.2 65.62,11.48 65.11,12 U61.4
$2N9135: length 4
  Top Layer w0.254: 68.58,11.48 70.45,11.48 70.96,11.99 70.96,13.44 U61.6
$2N9146: length 3
  Top Layer w0.178: R177.2 56.86,46.58 U60.9
$2N9165: length 10.3
  Top Layer w0.178: D29.1 54.44,56.44 52.92,54.92 51.65,54.92 51.11,54.38 C143.2 52.2,52.81 C144.1 55.15,52.63 U60.1
$2N9166: length 4.6
  Top Layer w0.178: U60.4 54.19,51.11 53.93,50.85 51.27,50.85 51.11,51.02 C145.2
$2N9167: length 4.5
  Top Layer w0.178: C144.2 51.11,52.29 51.28,52.11 U60.2
$2N9172: length 3.3
  Top Layer w0.254: U60.10 57.36,48.57 58.25,47.68 58.25,46.46
$2N9173: length 3.1
  Top Layer w0.178: U60.3 53.81,51.61 53.56,51.36 C145.1
$2N10141: length 3.3
  Top Layer w0.178: R181.2 43.14,55.37 U64.9
$2N10142: length 3
  Top Layer w0.178: U64.10 42.64,56.14 R182.2
$2N10145: length 9.1
  Top Layer w0.178: C149.2 C150.1 47.78,50.11 U64.1
  Top Layer w0.254: C149.2 47.8,47.9 46.19,46.28 D30.1
$2N10146: length 4.5
  Top Layer w0.178: C150.2 48.89,50.43 48.72,50.6 44.84,50.6 U64.2
$2N10147: length 3.1
  Top Layer w0.178: C151.1 46.57,51.36 46.32,51.11 44.83,51.11 U64.3
$2N10151: length 10.8
  Top Layer w0.178: U64.12 41.64,54.39 40.86,55.17 40.86,56.57 40.3,57.13 R184.2 40.22,57.59 40.6,57.97 44.92,57.97 45.3,57.59 R183.2
$2N10190: length 4.7
  Top Layer w0.178: C151.2 48.89,51.71 48.6,52 46.57,52 46.19,51.61 U64.4
$2N10191: length 4
  Top Layer w0.254: U65.6 U65.5 46.07,12.13 45.43,11.48 43.69,11.48
$2N10196: length 3.2
  Top Layer w0.254: C154.2 40.98,11.48 40.22,12.25 U65.4

## Copper pours and planes (outline as drawn; the poured copper is in the pictures)
GND_MOTO on Top Layer: -5.37,78.29 107.15,78.29 107.15,3.48 -5.37,3.48
GND_MOTO on Bottom Layer: -4.86,81.97 107.53,81.97 107.53,3.99 -4.86,3.99
GND_MOTO on Inner1: 0.26,76.52 99.74,76.52 99.74,10.27 0.26,10.27
GND_MOTO on Inner1: 19.97,41.29 32.62,41.29 32.62,25.05 19.97,25.05
VCC_BAT on Top Layer: 8.34,43.49 10.5,41.33 42.59,41.33 43.64,40.28 43.64,34.73 43.9,34.47 56.6,34.47 56.73,34.6 56.73,42.85 55.72,43.87 53.18,43.87 51.78,45.27 44.16,45.27 41.62,47.81 15.42,47.81 13.12,50.11 9.51,50.11 8.34,48.95
VCC_BAT on Top Layer: 42.25,16.8 43.15,15.9 56.38,15.9 56.38,24.64 56.5,25.4 43.2,25.4 43.01,25.58 42.25,24.82
VCC_BAT on Top Layer: 10.5,41.46 10.5,21.26 21.93,9.83 57.62,9.83 58.51,10.72 58.51,16.06 57.37,17.2 43.18,17.2 40.01,14.02 38.82,14.02 18.76,34.08 18.76,41.46 15.58,41.46 15.33,41.71 10.76,41.71
VCC_BAT on Inner1: 8.64,49.93 56.53,49.93 56.53,12.77 8.64,12.77
VCC_BAT on Inner2: 0.26,59.08 58.07,59.08 58.07,10.27 0.26,10.27
VCC_BAT on Inner2: 5.84,76.52 99.74,76.52 99.74,10.27 5.84,10.27
SH1_2 on Top Layer: 50.06,34.98 67.21,34.98 67.21,29.39 50.06,29.39
SH1_2 on Inner1: 50.17,41.94 69.72,41.94 69.72,29.48 50.17,29.48
SH1_2 on Inner2: 50.18,41.91 69.72,41.91 69.72,29.54 50.18,29.54
SH1_3 on Top Layer: 32.73,34.98 49.87,34.98 49.87,29.39 32.73,29.39
SH1_3 on Inner1: 30.22,41.92 49.91,41.92 49.91,29.57 30.22,29.57
SH1_3 on Inner2: 30.22,41.92 49.93,41.92 49.93,29.48 30.22,29.48
SH2_2 on Top Layer: 50.07,29.17 67.22,29.17 67.22,23.58 50.07,23.58
SH2_2 on Inner1: 50.17,29.22 69.65,29.22 69.65,17.24 50.17,17.24
SH2_2 on Inner2: 50.18,29.29 69.67,29.29 69.67,17.21 50.18,17.21
SH2_3 on Top Layer: 32.76,29.17 49.91,29.17 49.91,23.58 32.76,23.58
SH2_3 on Inner1: 30.22,29.32 49.91,29.32 49.91,17.22 30.22,17.22
SH2_3 on Inner2: 30.22,29.22 49.93,29.22 49.93,17.22 30.22,17.22
SP_2 on Top Layer: 65.79,23.09 65.79,18.51 63.92,14.36 61.23,14.36 56.82,15.4 56.82,23.07 61.12,23.07 61.14,23.09
SP_2 on Top Layer: 57.02,42.16 57.02,36.12 57.46,35.68 61.13,35.68 61.27,35.81 61.27,41.52 60.38,42.41 57.46,42.41 57.34,42.28 57.15,42.28
SP_2 on Bottom Layer: 57.61,16.82 49.65,41.78 66.46,41.78 69.9,38.33 69.9,20.55 66.11,16.75
SP_3 on Top Layer: 34.18,22.91 34.18,18.34 36.04,14.19 38.73,14.19 43.14,15.23 43.14,22.89 38.85,22.89 38.82,22.91
SP_3 on Top Layer: 38.89,42.09 38.89,36.06 39.33,35.61 43,35.61 43.14,35.75 43.14,41.46 42.25,42.35 39.33,42.35 39.21,42.22 39.01,42.22
SP_3 on Bottom Layer: 50.01,42.08 41.86,17.05 33.21,17.05 29.76,20.5 29.76,38.28 33.56,42.08

Small or netless copper shapes (teardrops, artwork), in the pictures only: 235 on Top Layer, 86 on Bottom Layer, 21 on Inner1, 4 on Inner2

## Text on the board
Bottom Silkscreen Layer: JLCJLCJLC | EN2 | GND | PH2 | DIR2 | IOUT2 | DIR3 | STL2 | IOUT3 | STL3 | EN3 | VCC | PH3 | Designed By / SongJC | Ver 1.1
Top Layer: 华侨大学 / 鹭岛躺赢狗 / 25.3.16
Top Silkscreen Layer: OFF | ON | 奶龙是你吧 | Ver 1.1 | 去找女朋友吧 | 去打GO吧 | 去打瓦吧 | 软件拿了MVP！ | 去睡觉吧 | 去休息吧 | 森林北的白鹭 | 去充电吧
